# EasyEDA Pro project 主板&9V稳压.epro, schematic 主板V2

## Sheets
1 电源: Board Name: 主板V2; Create Date: 2025-04-24; Page Name: 电源; Project Name: （5月更新）主板&9V稳压; Schematic Name: 主板V2; Update Date: 2025-05-08; Company: 嘉立创EDA; Page Size: A4; Version: V1.0
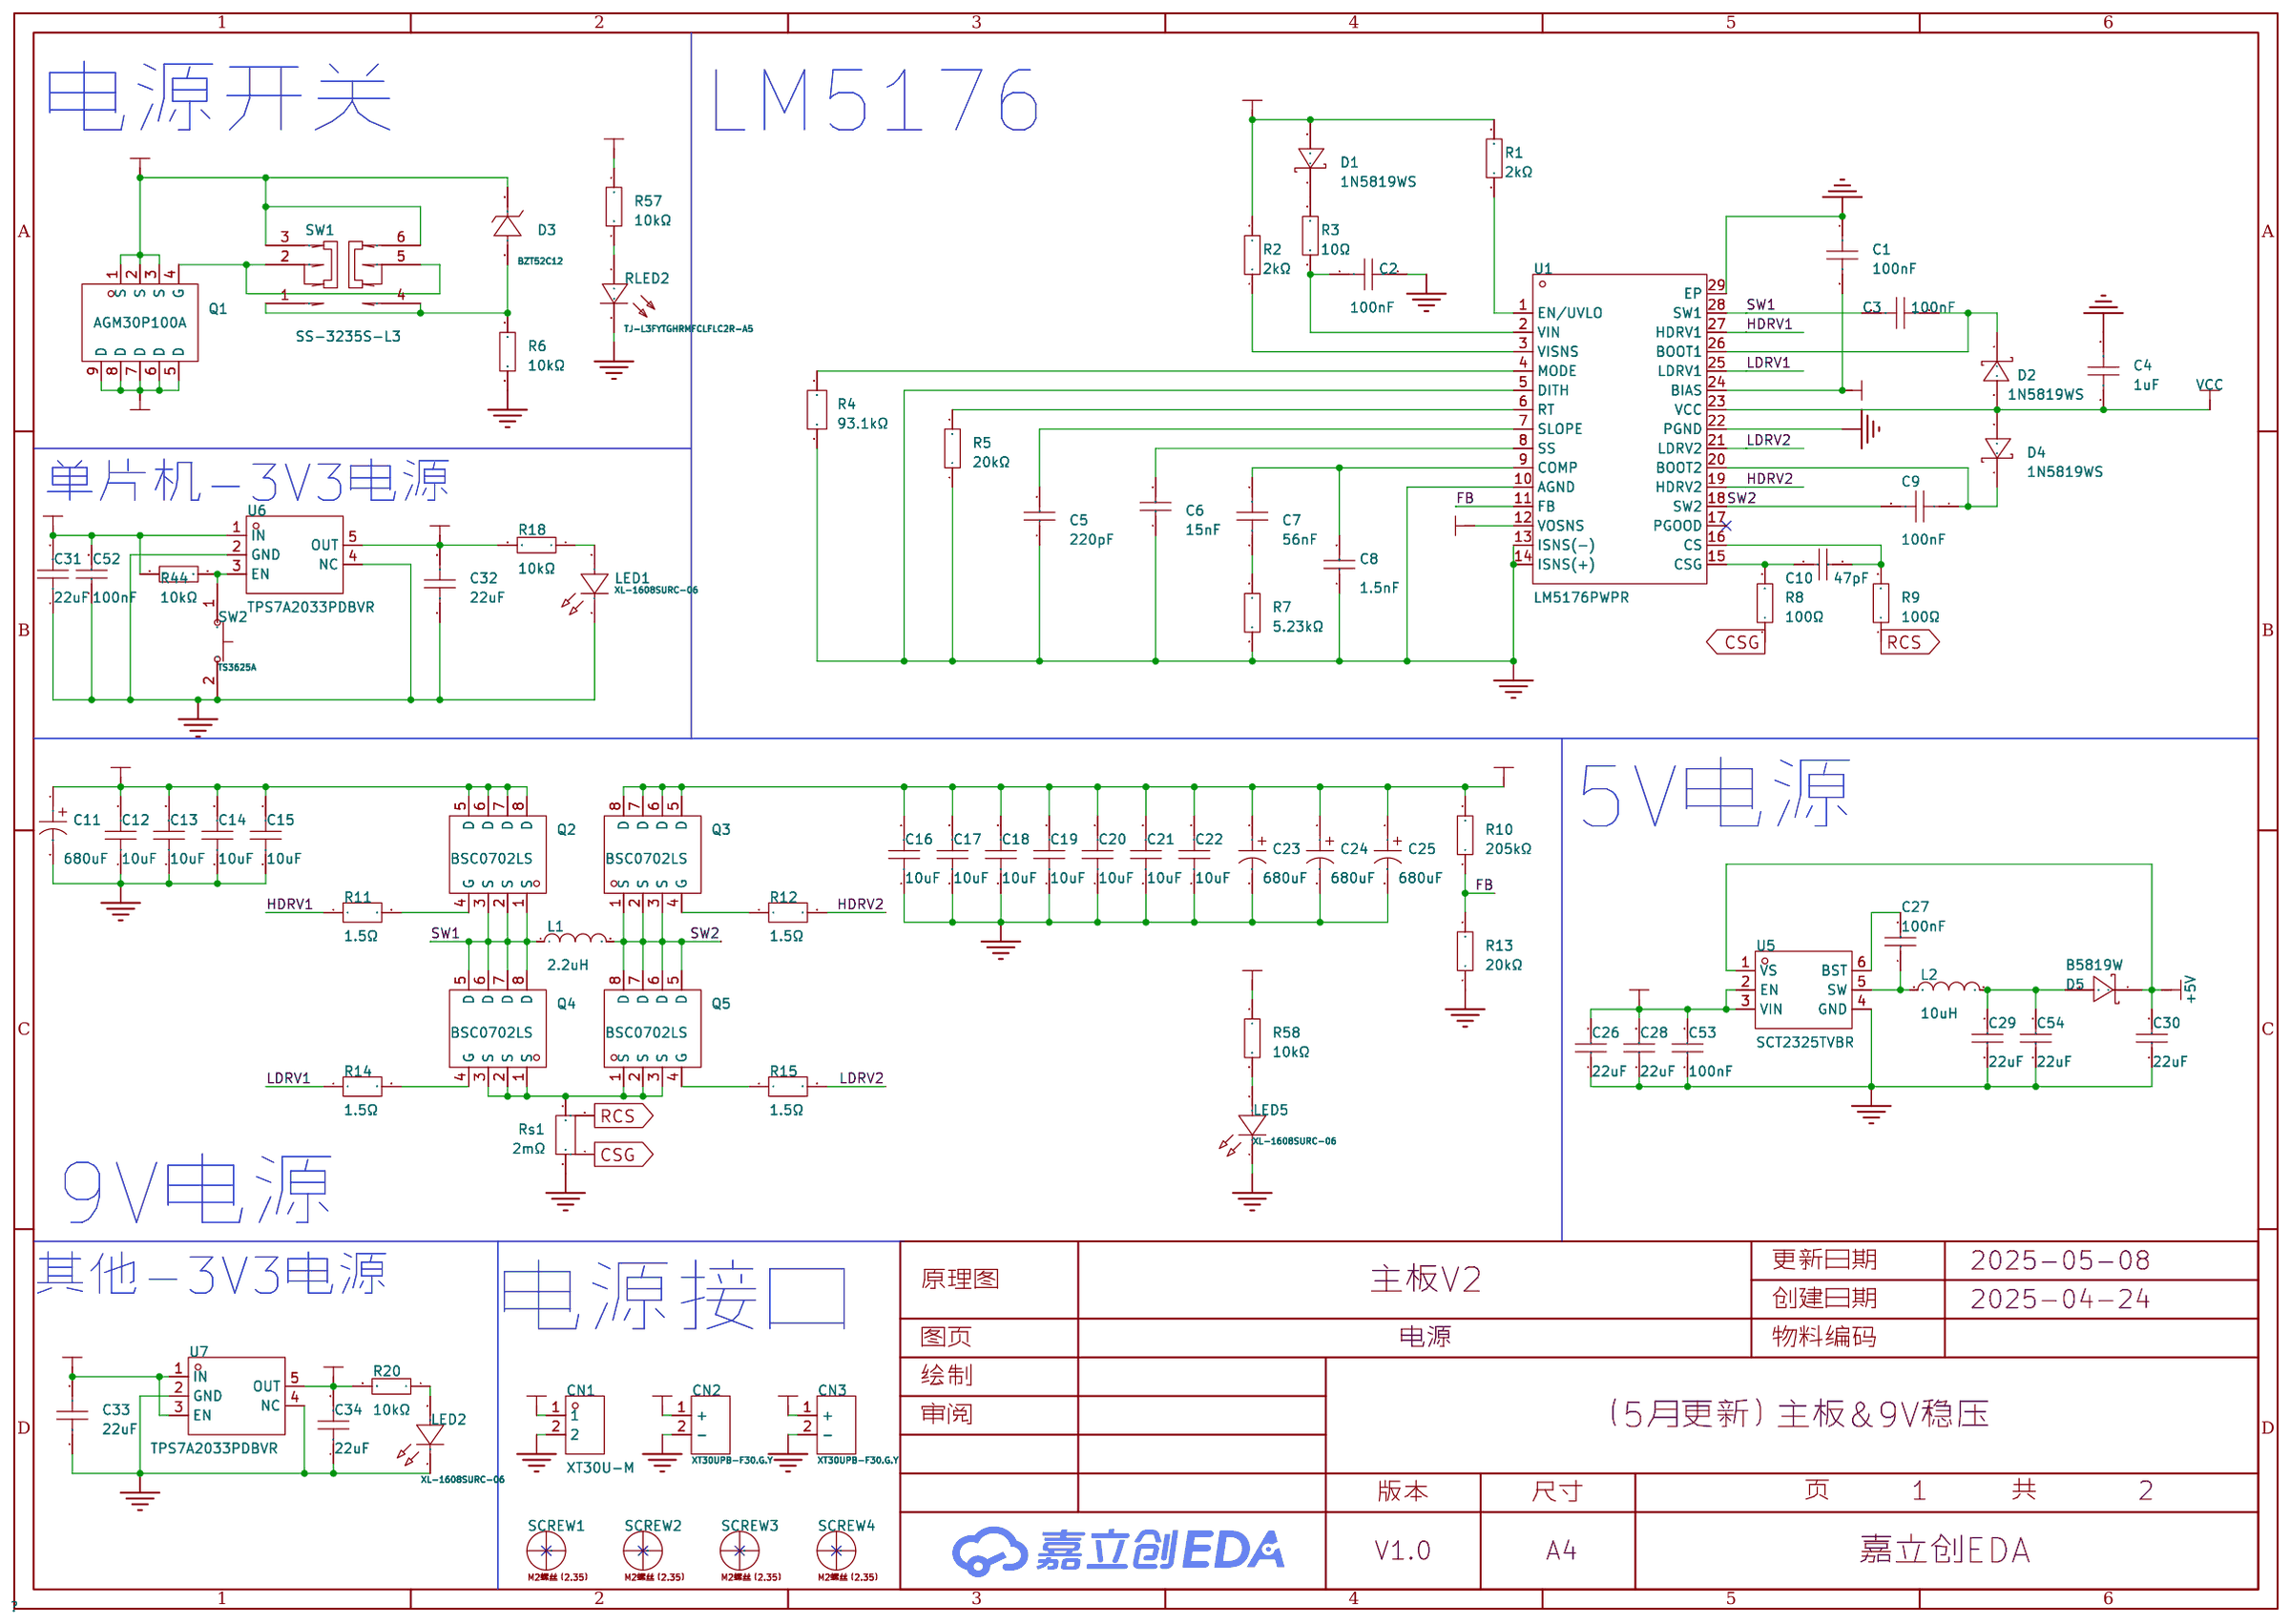
[diagram p2: 电源]
2 控制: Page Name: 控制; Project Name: （测试中）主板&9V稳压（螺丝孔扩大）; Update Date: 2025-05-04
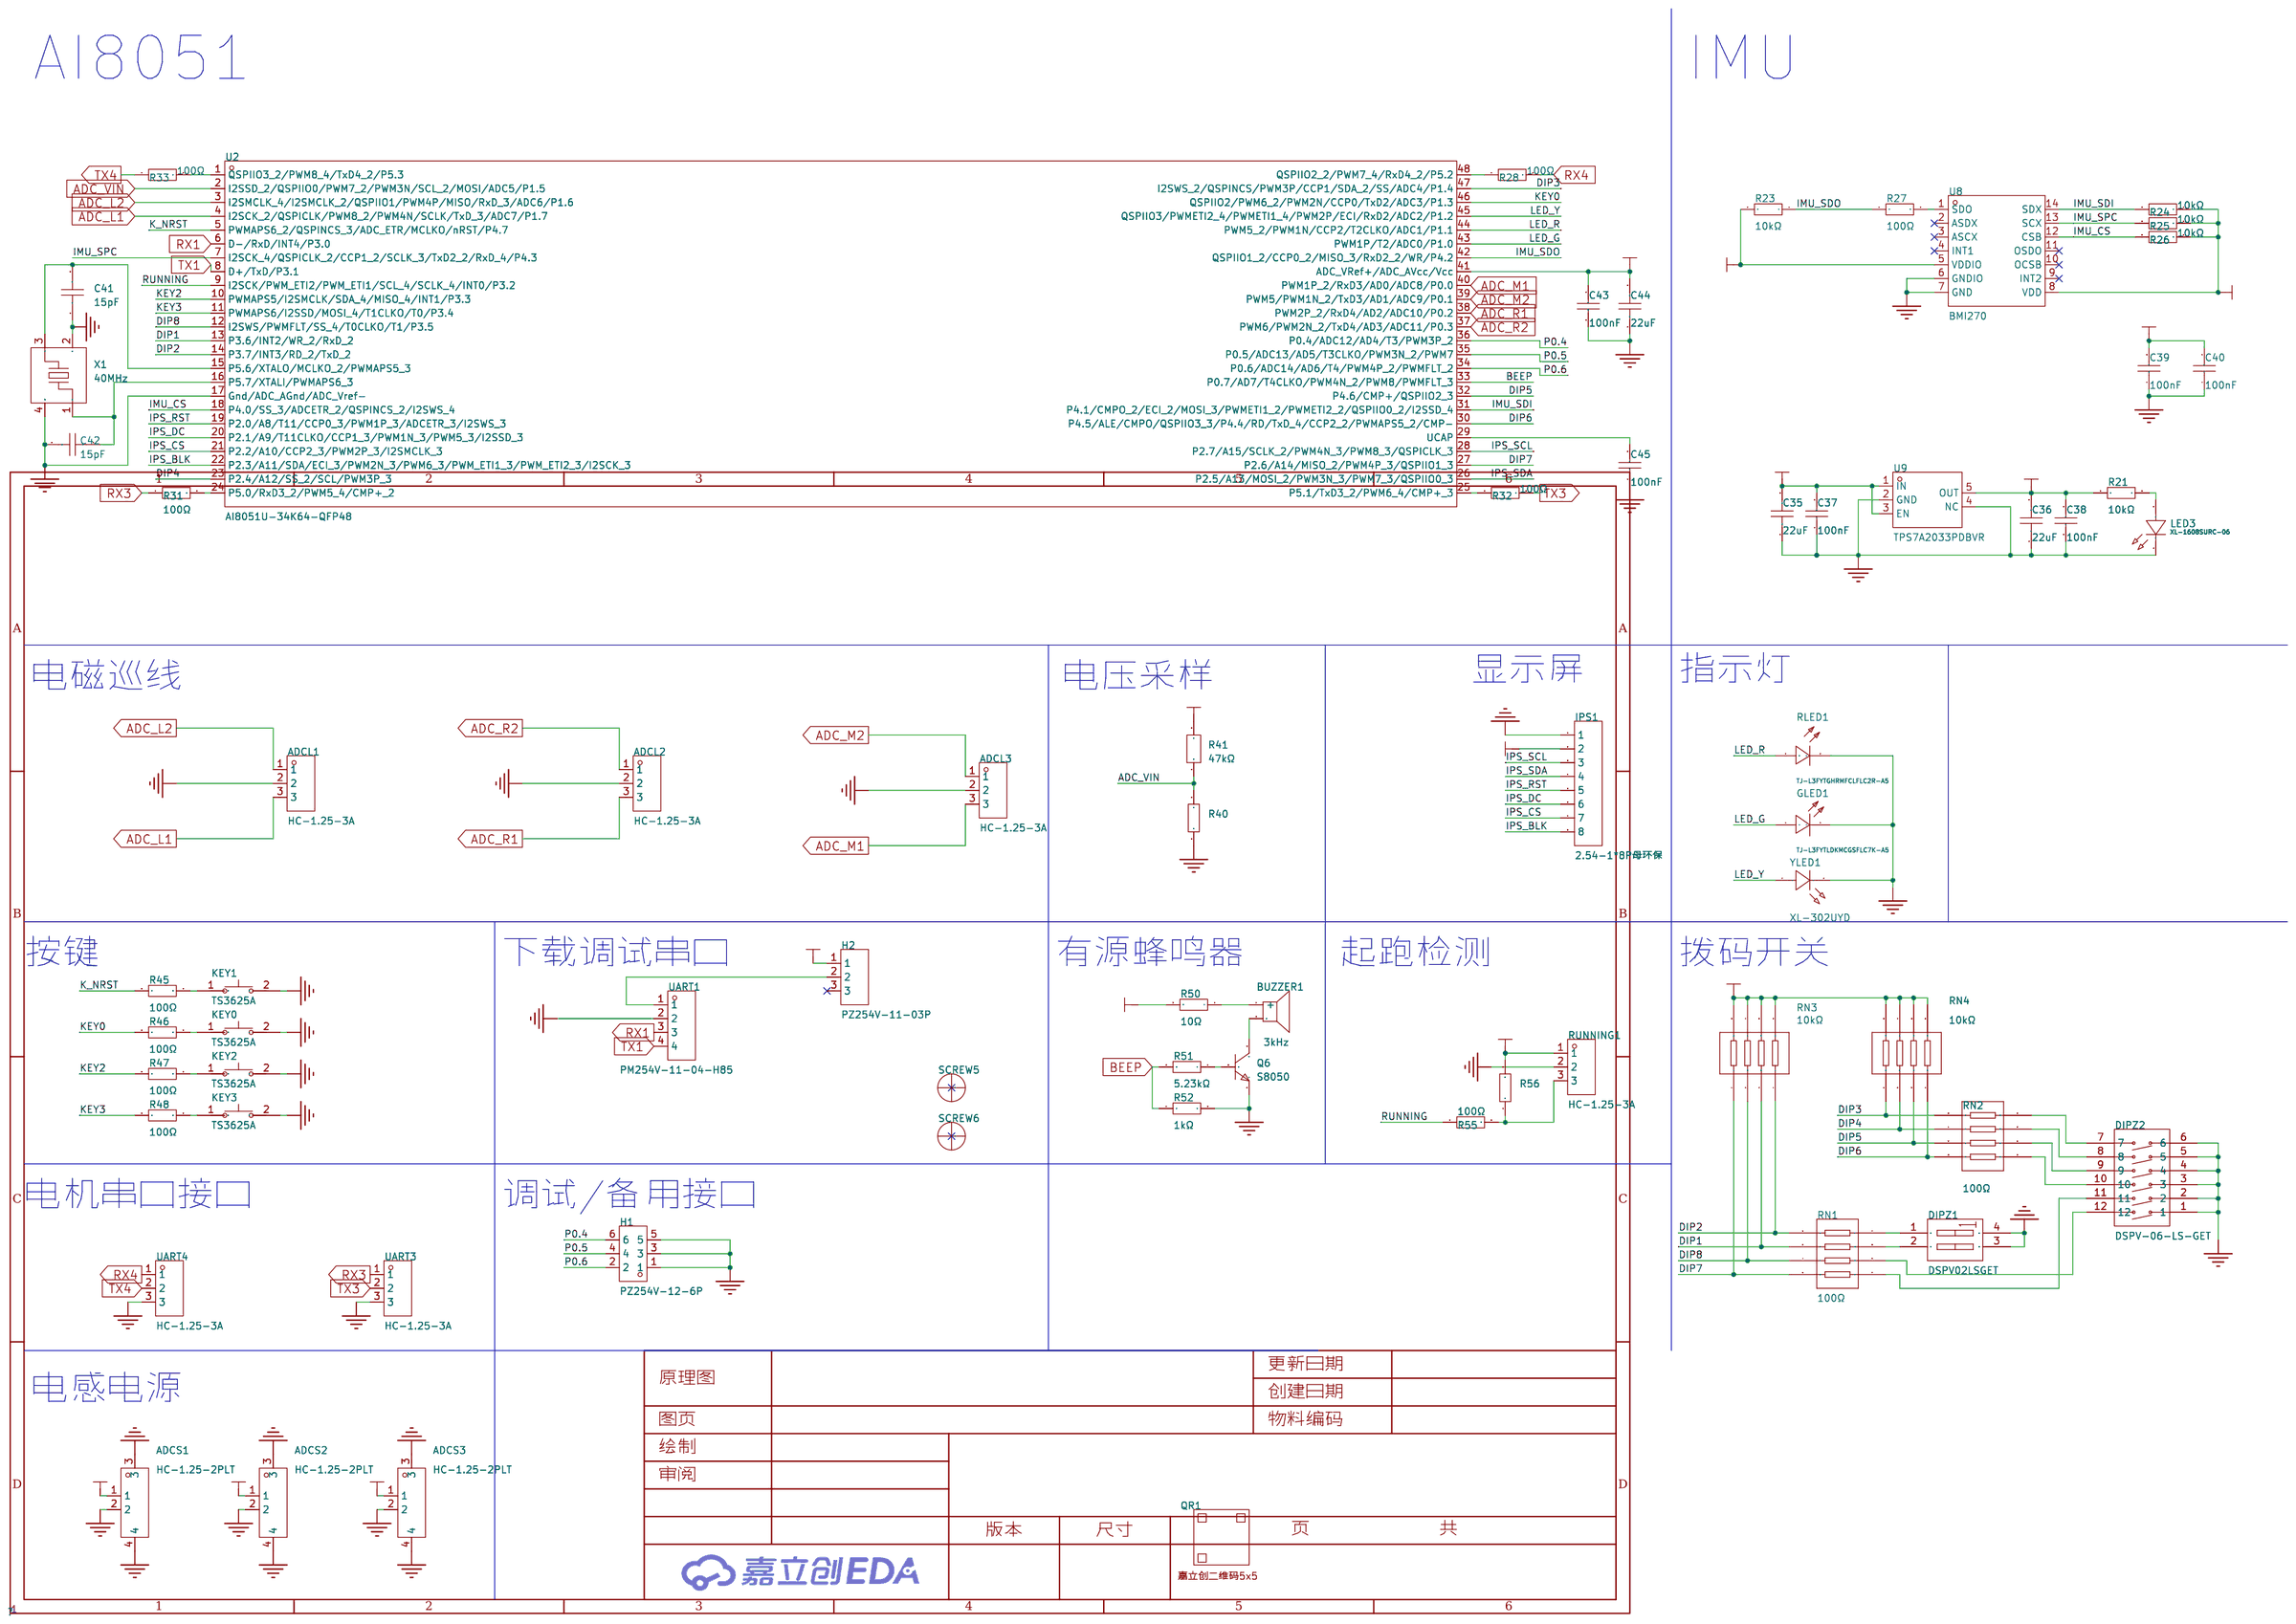
[diagram p3: 控制]

## Parts
sheet 控制
ADCL1  HC-1.25-3A  [CONN-TH_3P-P1.25_HCTL_HC-1.25-3A]
ADCL2  HC-1.25-3A  [CONN-TH_3P-P1.25_HCTL_HC-1.25-3A]
ADCL3  HC-1.25-3A  [CONN-TH_3P-P1.25_HCTL_HC-1.25-3A]
ADCS1  HC-1.25-2PLT  [CONN-SMD_HC-1.25-2PLT]
ADCS2  HC-1.25-2PLT  [CONN-SMD_HC-1.25-2PLT]
ADCS3  HC-1.25-2PLT  [CONN-SMD_HC-1.25-2PLT]
BUZZER1  3kHz  [BUZ-SMD_L9.6-W9.6-LS10.0-R]
C35  22uF  [C0603]
C36  22uF  [C0603]
C37  100nF  [C0603]
C38  100nF  [C0603]
C39  100nF  [C0603]
C40  100nF  [C0603]
C41  15pF  [C0603]
C42  15pF  [C0603]
C43  100nF  [C0603]
C44  22uF  [C0603]
C45  100nF  [C0603]
DIPZ1  DSPV02LSGET  [SW-SMD_DSPV02LSGET]
DIPZ2  DSPV-06-LS-GET  [SW-SMD_DSPV-06-LS-GET]
GLED1  TJ-L3FYTLDKMCGSFLC7K-A5  [LED-TH_BD3.8-P2.54-FD]
H1  PZ254V-12-6P  [HDR-TH_6P-P2.54-V-M-R2-C3-S2.54]
H2  PZ254V-11-03P  [HDR-TH_3P-P2.54-V-M]
IPS1  2.54-1*8P母环保  [HDR-TH_8P-P2.54-V-F-1]
KEY0  TS3625A  [KEY-SMD_L6.0-W3.5-LS8.4]
KEY1  TS3625A  [KEY-SMD_L6.0-W3.5-LS8.4]
KEY2  TS3625A  [KEY-SMD_L6.0-W3.5-LS8.4]
KEY3  TS3625A  [KEY-SMD_L6.0-W3.5-LS8.4]
LED3  XL-1608SURC-06  [LED0603-RD_RED]
Q6  S8050  [SOT-23-3_L2.9-W1.3-P1.90-LS2.3-BR]
QR1  -  [JLC-QRCODE-5x5]
R21  10kΩ  [R0603]
R23  10kΩ  [R0603]
R24  10kΩ  [R0603]
R25  10kΩ  [R0603]
R26  10kΩ  [R0603]
R27  100Ω  [R0603]
R28  100Ω  [R0603]
R31  100Ω  [R0603]
R32  100Ω  [R0603]
R33  100Ω  [R0603]
R40  10kΩ  [R0603]
R41  47kΩ  [R0603]
R45  100Ω  [R0603]
R46  100Ω  [R0603]
R47  100Ω  [R0603]
R48  100Ω  [R0603]
R50  10Ω  [R0603]
R51  5.23kΩ  [R0603]
R52  1kΩ  [R0603]
R55  100Ω  [R0603]
R56  10kΩ  [R0603]
RLED1  TJ-L3FYTGHRMFCLFLC2R-A5  [LED-TH_BD3.9-P2.54-FD]
RN1  100Ω  [RES-ARRAY-SMD_0603-8P-L3.2-W1.6-BL]
RN2  100Ω  [RES-ARRAY-SMD_0603-8P-L3.2-W1.6-BL]
RN3  10kΩ  [RES-ARRAY-SMD_0603-8P-L3.2-W1.6-BL]
RN4  10kΩ  [RES-ARRAY-SMD_0603-8P-L3.2-W1.6-BL]
RUNNING1  HC-1.25-3A  [CONN-TH_3P-P1.25_HCTL_HC-1.25-3A]
SCREW5  -  [M2螺丝]
SCREW6  -  [M2螺丝]
U2  AI8051U-34K64-QFP48  [LQFP-48_L7.0-W7.0-P0.50-LS9.0-BL_1]
U8  BMI270  [LGA-14_L3.0-W2.5-P0.50-BR]
U9  TPS7A2033PDBVR  [SOT-23-5_L2.9-W1.6-P0.95-LS2.8-BR]
UART1  PM254V-11-04-H85  [HDR-TH_4P-P2.54-V-F]
UART3  HC-1.25-3A  [CONN-TH_3P-P1.25_HCTL_HC-1.25-3A]
UART4  HC-1.25-3A  [CONN-TH_3P-P1.25_HCTL_HC-1.25-3A]
X1  40MHz  [CRYSTAL-SMD_4P-L3.2-W2.5-BL]
YLED1  XL-302UYD  [LED-TH_BD3.8-P2.54-FD_YELLOW]
sheet 电源
C1  100nF  [C0603]
C2  100nF  [C0603]
C3  100nF  [C0603]
C4  1uF  [C0603]
C5  220pF  [C0603]
C6  15nF  [C0603]
C7  56nF  [C0603]
C8  1.5nF  [C0603]
C9  100nF  [C0603]
C10  47pF  [C0603]
C11  680uF  [CAP-TH_BD8.0-P3.50-D0.6-FD]
C12  10uF  [C1206]
C13  10uF  [C1206]
C14  10uF  [C1206]
C15  10uF  [C1206]
C16  10uF  [C1206]
C17  10uF  [C1206]
C18  10uF  [C1206]
C19  10uF  [C1206]
C20  10uF  [C1206]
C21  10uF  [C1206]
C22  10uF  [C1206]
C23  680uF  [CAP-TH_BD8.0-P3.50-D0.6-FD]
C24  680uF  [CAP-TH_BD8.0-P3.50-D0.6-FD]
C25  680uF  [CAP-TH_BD8.0-P3.50-D0.6-FD]
C26  22uF  [C1206]
C27  100nF  [C0603]
C28  22uF  [C1206]
C29  22uF  [C1206]
C30  22uF  [C1206]
C31  22uF  [C0603]
C32  22uF  [C0603]
C33  22uF  [C0603]
C34  22uF  [C0603]
C52  100nF  [C0603]
C53  100nF  [C0603]
C54  22uF  [C1206]
CN1  XT30U-M  [CONN-TH_XT30U-M]
CN2  XT30UPB-F30.G.Y  [CONN-TH_XT30UPB-F]
CN3  XT30UPB-F30.G.Y  [CONN-TH_XT30UPB-F]
D1  1N5819WS  [SOD-323_L1.8-W1.3-LS2.5-RD]
D2  1N5819WS  [SOD-323_L1.8-W1.3-LS2.5-RD]
D3  BZT52C12  [SOD-123_L2.7-W1.6-LS3.7-RD]
D4  1N5819WS  [SOD-323_L1.8-W1.3-LS2.5-RD]
D5  B5819W  [SOD-123_L2.8-W1.8-LS3.7-RD]
L1  2.2uH  [IND-SMD_L11.9-W11.0]
L2  10uH  [IND-SMD_L3.0-W3.0_FTC303020D]
LED1  XL-1608SURC-06  [LED0603-RD_RED]
LED2  XL-1608SURC-06  [LED0603-RD_RED]
LED5  XL-1608SURC-06  [LED0603-RD_RED]
Q1  AGM30P100A  [PDFN-8_L5.8-W4.9-P1.27-LS6.1-BL-A]
Q2  BSC0702LS  [PG-TDSON-8_L5.0-W6.0-P1.27-BL-EP]
Q3  BSC0702LS  [PG-TDSON-8_L5.0-W6.0-P1.27-BL-EP]
Q4  BSC0702LS  [PG-TDSON-8_L5.0-W6.0-P1.27-BL-EP]
Q5  BSC0702LS  [PG-TDSON-8_L5.0-W6.0-P1.27-BL-EP]
R1  2kΩ  [R0603]
R2  2kΩ  [R0603]
R3  10Ω  [R0603]
R4  93.1kΩ  [R0603]
R5  20kΩ  [R0603]
R6  10kΩ  [R0603]
R7  5.23kΩ  [R0603]
R8  100Ω  [R0603]
R9  100Ω  [R0603]
R10  205kΩ  [R0603]
R11  1.5Ω  [R0603]
R12  1.5Ω  [R0603]
R13  20kΩ  [R0603]
R14  1.5Ω  [R0603]
R15  1.5Ω  [R0603]
R18  10kΩ  [R0603]
R20  10kΩ  [R0603]
R44  10kΩ  [R0603]
R57  10kΩ  [R0603]
R58  10kΩ  [R0603]
RLED2  TJ-L3FYTGHRMFCLFLC2R-A5  [LED-TH_BD3.9-P2.54-FD]
Rs1  2mΩ  [RES-SMD_4P-L3.0-W3.8_HOBB1216]
SCREW1  -  [M2螺丝（2.35）]
SCREW2  -  [M2螺丝（2.35）]
SCREW3  -  [M2螺丝（2.35）]
SCREW4  -  [M2螺丝（2.35）]
SW1  SS-3235S-L3  [SW-SMD_SS-3235S-L3.00]
SW2  TS3625A  [KEY-SMD_L6.0-W3.5-LS8.4]
U1  LM5176PWPR  [HTSSOP-28_L9.7-W4.4-P0.65-LS6.4-BL-EP]
U5  SCT2325TVBR  [TSOT-23-6_L2.9-W1.6-P0.95-LS2.8-BR]
U6  TPS7A2033PDBVR  [SOT-23-5_L2.9-W1.6-P0.95-LS2.8-BR]
U7  TPS7A2033PDBVR  [SOT-23-5_L2.9-W1.6-P0.95-LS2.8-BR]

## Library data of the parts
ADCL1-ADCL3 RUNNING1 UART3 UART4 = HC-1.25-3A: 插针结构:1x3P;间距:1.25mm;安装方式:直插;参考系列:PicoBlade(MX 1.25);总PIN数:3P;排数:1;每排PIN数:3;行距:-;额定电流:1A;触头材质:黄铜;触头镀层:锡;工作温度范围:-25℃~+85℃;; LCSC Part Name: 1x3P 间距:1.25mm 直插 系列:PicoBlade(MX 1.25); Supplier Part: C2845521; Manufacturer: HCTL(华灿天禄); Supplier Footprint: 插件,P=1.25mm; JLCPCB Part Class: 扩展库; Datasheet: https://atta.szlcsc.com/upload/public/pdf/source/20230707/9C9BC153C15CECDA5FD17EC6041C1792.pdf; Supplier: LCSC; Pins Structure: 1x3P; Pitch: 1.25mm; Mounting Style: 直插; Reference Series: PicoBlade(MX 1.25); Number of Pins: 3P; Number of Rows: 1; Number of PINs Per Row: 3; Current Rating (Max): 1A; Contact Material: 黄铜; Contact Plating: 锡; Operating Temperature Range: -25℃~+85℃; Rated Voltage (Max): 125V; Plastic Material: PA46; Flame Retardant Rating: UL94V-0; Z-Height of the Board: 4.7mm; X-Length of Bottom Edge on Board (Spacing Line): 5.5mm; Y-Width of Bottom Edge on Board: 3.2mm
ADCS1-ADCS3 = HC-1.25-2PLT: 插针结构:1x2P;间距:1.25mm;安装方式:立贴;参考系列:PicoBlade(MX 1.25);总PIN数:2P;排数:1;每排PIN数:2;行距:-;额定电流:2A;触头材质:黄铜;触头镀层:锡;工作温度范围:-25℃~+85℃;; LCSC Part Name: 1x2P 间距:1.25mm 立贴 系列:PicoBlade(MX 1.25); Supplier Part: C2845388; Manufacturer: HCTL(华灿天禄); Supplier Footprint: SMD,P=1.25mm; JLCPCB Part Class: 扩展库; Datasheet: https://atta.szlcsc.com/upload/public/pdf/source/20230707/8E5913B5A3195C18F5EE12EA4CB86B82.pdf; Supplier: LCSC; Pins Structure: 1x2P; Pitch: 1.25mm; Mounting Style: 立贴; Reference Series: PicoBlade(MX 1.25); Number of Pins: 2P; Number of Rows: 1; Number of PINs Per Row: 2; Current Rating (Max): 2A; Contact Material: 黄铜; Contact Plating: 锡; Operating Temperature Range: -25℃~+85℃; Rated Voltage (Max): 250V; Plastic Material: LCP; Flame Retardant Rating: UL94V-0; Supplementary Features: 辅助焊脚; Z-Height of the Board: 4.75mm; X-Length of Bottom Edge on Board (Spacing Line): 7.3mm; Y-Width of Bottom Edge on Board: 4.2mm
BUZZER1 = FUET-9650B-3V: 驱动方式:有源(内含驱动线路);构造类型:电磁式;频率:3kHz;声压(SPL):85dB;; LCSC Part Name: 电压 3V 频率 3KHZ; Supplier Part: C391032; Manufacturer: FUET(福声科技); Supplier Footprint: SMD,9.6x9.6mm; JLCPCB Part Class: 扩展库; Datasheet: https://atta.szlcsc.com/upload/public/pdf/source/20191031/C391032_DAAC75D3C9B9135EF0EA60697D179A21.pdf; Supplier: LCSC; Driver Circuitry: 有源(内含驱动线路); Technology: 电磁式; Voltage - Supply: 2V~5V; Sound Pressure Level(SPL): 85dB; Length: 9.6mm; Width: 9.6mm; Height: 5.5mm
C31-C36 C44 = CL10A226MQ8NRNC: 容值:22uF;精度:±20%;额定电压:6.3V;材质(温度系数):X5R;; LCSC Part Name: 22uF ±20% 6.3V; Supplier Part: C59461; Manufacturer: SAMSUNG(三星); Supplier Footprint: 0603; JLCPCB Part Class: 基础库; Datasheet: https://atta.szlcsc.com/upload/public/pdf/source/20160218/1457707763339.pdf; Supplier: LCSC; Tolerance: ±20%; Voltage Rated: 6.3V; Temperature Coefficient: X5R
C1-C3 C9 C27 C37-C40 C43 C45 C52 C53 = CC0603KRX7R9BB104: 容值:100nF;精度:±10%;额定电压:50V;材质(温度系数):X7R;; LCSC Part Name: 100nF ±10% 50V; Supplier Part: C14663; Manufacturer: YAGEO(国巨); Supplier Footprint: 0603; JLCPCB Part Class: 基础库; Datasheet: https://atta.szlcsc.com/upload/public/pdf/source/20180910/C282072_33301C7F631E79921B82A8DAC6BCC5B3.pdf; Supplier: LCSC; Tolerance: ±10%; Voltage Rated: 50V; Temperature Coefficient: X7R
C41 C42 = CC0603FRNPO9BN150: 容值:15pF;精度:±1%;额定电压:50V;材质(温度系数):NP0;; LCSC Part Name: 15pF ±1% 50V; Supplier Part: C519483; Manufacturer: YAGEO(国巨); Supplier Footprint: 0603; JLCPCB Part Class: Extended Part; Datasheet: https://atta.szlcsc.com/upload/public/pdf/source/20200423/C519483_4C1E224DC9F50100F87DB4C4CB862A47.pdf; Supplier: LCSC; Tolerance: ±1%; Voltage Rated: 50V; Temperature Coefficient: NP0
DIPZ1 = DSPV02LSGET_C3293167: 类型:琴键;电路结构:单刀单掷;开关位数:2位;额定电流:25mA;额定电压:24V;使用寿命:3千次;颜色:黑色;; LCSC Part Name: 2位 2.54间距贴片型 琴键式侧拨 黑色拨码开关 拨动开关; Supplier Part: C3293167; Manufacturer: 康深; Supplier Footprint: SMD-4P,6.5x9mm; JLCPCB Part Class: 扩展库; Datasheet: https://atta.szlcsc.com/upload/public/pdf/source/20220713/19B05D0406997D0F6DA59F33D283E3E5.pdf; Supplier: LCSC; Type: 琴键; Circuit: 单刀单掷; Number of Positions: 2位; Lead Pitch: 2.54mm; Current Rating: 25mA; Voltage Rating: 24V; Operating Temperature: -30℃~+85℃; Operating Life: 3千次; Color: 黑色
DIPZ2 = DSPV-06-LS-GET: 类型:琴键;电路结构:单刀单掷;开关位数:6位;额定电流:25mA;额定电压:24V;使用寿命:3千次;颜色:黑色;; LCSC Part Name: 2.54mm间距 6位 琴键式贴片侧拨 黑色 拨码开关; Supplier Part: C7503432; Manufacturer: XUNPU(讯普); Supplier Footprint: SMD,P=2.54mm; JLCPCB Part Class: 扩展库; Datasheet: https://atta.szlcsc.com/upload/public/pdf/source/20231023/A13819BA6D566F6DF481D09D8C1ADCC0.pdf; Supplier: LCSC; Type: 琴键; Circuit: 单刀单掷; Number of Positions: 6位; Lead Pitch: 2.54mm; Current Rating: 25mA; Voltage Rating: 24V; Operating Life: 3千次; Color: 黑色
GLED1 = TJ-L3FYTLDKMCGSFLC7K-A5: 灯头类型:3mm圆形灯头;发光颜色:黄绿色;功率:72mW;正向电流:20mA;主波长:565nm~575nm;二极管配置:-;透镜颜色:雾状绿透镜;色温:-;发光角度:45°;载带方式:-;工作温度:-20℃~+80℃;; LCSC Part Name: 普绿/黄绿; Supplier Part: C440524; Manufacturer: TOGIALED(统佳); Supplier Footprint: 插件,D=3mm; JLCPCB Part Class: 扩展库; Datasheet: https://atta.szlcsc.com/upload/public/pdf/source/20191029/C440524_094602A0DCAC6D730972557558F5FC64.pdf; Supplier: LCSC; Lamp Holder Type: 3mm圆形灯头; Emitted Color: 黄绿色; Power Dissipation: 72mW; Forward Current: 20mA; Dominant Wavelength: 565nm~575nm; Peak Wavelength: 575nm; Lens Color: 雾状绿透镜; Viewing Angle: 45°; Operating Temperature: -20℃~+80℃
H1 = PZ254V-12-6P: 插针结构:2x3P;间距:2.54mm;行距:2.54mm;圆针/方针:方针;安装类型:直插;排数:双排;总PIN位数:6P;额定电流:-;额定电压:-;配合针长度:6mm;塑高:2.5mm;端接针长度:3mm;触头材质:黄铜;触头镀层:-;工作温度范围:-40℃~+105℃;颜色:黑色;; LCSC Part Name: 间距:2.54mm 2x3P 直插 方针; Supplier Part: C492420; Manufacturer: XFCN(兴飞); Supplier Footprint: 插件,P=2.54mm; JLCPCB Part Class: 扩展库; Datasheet: https://atta.szlcsc.com/upload/public/pdf/source/20200309/C492420_BAECB307B001054C09D200388220EAE6.pdf; Supplier: LCSC; Pin Structure: 2x3P; Pitch: 2.54mm; Row Spacing: 2.54mm; Circluar Pins/Square Pins: 方针; Mounting Type: 直插; Number of Rows: 双排; Number of Pins: 6P; Length of Mating Pin: 6mm; Insulation Height: 2.5mm; Length of End Connection Pin: 3mm; Contact Material: 黄铜; Operating Temperature Range: -40℃~+105℃; Color: 黑色
H2 = PZ254V-11-03P: 插针结构:1x3P;间距:2.54mm;行距:-;圆针/方针:方针;安装方式:直插;排数:单排;总PIN位数:3P;额定电流:3A;额定电压:250V;配合针长度:6mm;塑高:2.5mm;端接针长度:3mm;工作温度:-40℃~+105℃;颜色:黑色;; LCSC Part Name: 1x3P 间距:2.54mm 方针 直插; Supplier Part: C2937625; Manufacturer: XFCN(兴飞); Supplier Footprint: 插件,P=2.54mm; JLCPCB Part Class: 扩展库; Datasheet: https://atta.szlcsc.com/upload/public/pdf/source/20200309/C492402_8335C3D49C4E4C618838D59BB1D024C1.pdf; Supplier: LCSC; Pin Structure: 1x3P; Pitch: 2.54mm; Circluar Pins/Square Pins: 方针; Mounting Type: 直插; Number of Rows: 单排; Number of Pins: 3P; Current Rating: 3A; Voltage Rating (Max): 250V; Length of Mating Pin: 6mm; Insulation Height: 2.5mm; Length of End Connection Pin: 3mm; Operating Temperature: -40℃~+105℃; Color: 黑色
IPS1 = 2.54-1*8P母环保: 插孔结构:1x8P;间距:2.54mm;行距:-;安装类型:直插;排数:单排;总孔位数:8P;塑高:-;触头材质:-;触头镀层:-;; LCSC Part Name: 间距:2.54mm 1x8P 直插; Supplier Part: C27438; Manufacturer: BOOMELE(博穆精密); Supplier Footprint: 插件,P=2.54mm; JLCPCB Part Class: 扩展库; Datasheet: https://atta.szlcsc.com/upload/public/pdf/source/20231221/1CA800C6799ED97958773716FAA1BFFE.pdf; Supplier: LCSC; Holes Structure: 1x8P; Pitch: 2.54mm; Mounting Type: 直插; Number of Rows: 单排; Number of Holes: 8P
KEY0-KEY3 SW2 = TS3625A: 电路结构:单刀单掷;按钮形状:矩形按钮;开关长度:6.1mm;开关宽度:3.65mm;开关高度:2.5mm;触点电流:50mA;额定电压(DC):12V;安装方式:立贴;带灯:-;作用力:250gf;机械寿命:-;; LCSC Part Name: 6.1*3.65*2.5mm 立贴 轻触开关; Supplier Part: C398053; Manufacturer: SHOU HAN(首韩); Supplier Footprint: SMD; Datasheet: https://atta.szlcsc.com/upload/public/pdf/source/20190620/C398053_EFFFB524A3F966B1F45EE8333D1EDECC.pdf; Supplier: LCSC; Circuit: 单刀单掷; Actuator Style: 矩形按钮; Switch Length: 6.1mm; Switch Width: 3.65mm; Switch Height: 2.5mm; Contact Current: 50mA; Voltage Rating (DC): 12V; Mounting Style: 立贴; Operating Force: 250gf
LED1-LED3 LED5 = XL-1608SURC-06: 发光颜色:红色;功率:55mW;正向电流:25mA;主波长:617nm~621nm;透镜颜色:无色透明透镜;色温:-;发光角度:120°;载带方式:正贴;工作温度:-30℃~+85℃;; Supplier Part: C965799; Manufacturer: XINGLIGHT(成兴光); Supplier Footprint: 0603; JLCPCB Part Class: 扩展库; Datasheet: https://atta.szlcsc.com/upload/public/pdf/source/20221102/D860AFDD1CDB02C5A8064103A32707E2.pdf; Supplier: LCSC; Emitted Color: 红色; Power Dissipation: 55mW; Forward Current: 25mA; Dominant Wavelength: 617nm~621nm; Peak Wavelength: 623nm; Lens Color: 无色透明透镜; Viewing Angle: 120°; Mounting Sytle: 正贴; Operating Temperature: -30℃~+85℃
Q6 = S8050_C20069125: 晶体管类型:NPN;集电极电流(Ic):500mA;集射极击穿电压(Vceo):25V;耗散功率(Pd):300mW;直流电流增益(hFE):120@50mA,1.0V;; LCSC Part Name: hFE:200-350，丝印:J3Y S8050; Supplier Part: C20069125; Manufacturer: 宏嘉诚; Supplier Footprint: SOT-23; JLCPCB Part Class: 扩展库; Datasheet: https://atta.szlcsc.com/upload/public/pdf/source/20250107/343E8B94B5C24D0D65D7D4B70E0B73F6.pdf; Supplier: LCSC; type: NPN; Current - Collector(Ic): 500mA; Collector - Emitter Voltage VCEO: 25V; Pd - Power Dissipation: 300mW; DC Current Gain: 120@50mA,1.0V; Transition frequency(fT): 100MHz; Current - Collector Cutoff: 100nA; Vce Saturation(VCE(sat)): 600mV; Operating Temperature: -55℃~+150℃
QR1 = 嘉立创二维码5x5: Check: false
R6 R18 R20 R21 R23-R26 R40 R44 R56-R58 = RC0603FR-0710KL: 电阻类型:厚膜电阻;阻值:10kΩ;精度:±1%;功率:100mW;最大工作电压:75V;温度系数:±100ppm/℃;; LCSC Part Name: 厚膜电阻 10kΩ ±1% 100mW; Supplier Part: C98220; Manufacturer: YAGEO(国巨); Supplier Footprint: 0603; JLCPCB Part Class: Extended Part; Datasheet: https://atta.szlcsc.com/upload/public/pdf/source/20180927/C295883_E8D83085EA81BD7DE0B2B681138C15EE.pdf; Supplier: LCSC; Type: 厚膜电阻; Tolerance: ±1%; Power(Watts): 100mW; Overload Voltage (Max): 75V; Temperature Coefficient: ±100ppm/℃; Operating Temperature Range: -55℃~+155℃
R8 R9 R27 R28 R31-R33 = RC0603FR-07100RL: 电阻类型:厚膜电阻;阻值:100Ω;精度:±1%;功率:100mW;最大工作电压:75V;温度系数:±100ppm/℃;; LCSC Part Name: 厚膜电阻 100Ω ±1% 100mW; Supplier Part: C105588; Manufacturer: YAGEO(国巨); Supplier Footprint: 0603; JLCPCB Part Class: 扩展库; Datasheet: https://atta.szlcsc.com/upload/public/pdf/source/20180316/70C0E2BDAE7FCC62C531A5A58D202EE1.pdf; Supplier: LCSC; Type: 厚膜电阻; Tolerance: ±1%; Power(Watts): 100mW; Overload Voltage (Max): 75V; Temperature Coefficient: ±100ppm/℃; Operating Temperature Range: -55℃~+155℃
R41 = FRC0603F4702TS: 电阻类型:厚膜电阻;阻值:47kΩ;精度:±1%;功率:100mW;最大工作电压:75V;温度系数:±100ppm/℃;; LCSC Part Name: 47kΩ ±1% 100mW 厚膜电阻; Supplier Part: C2907042; Manufacturer: FOJAN(富捷); Supplier Footprint: 0603; JLCPCB Part Class: 扩展库; Datasheet: https://atta.szlcsc.com/upload/public/pdf/source/20211221/925EC7D7225764EE0046F22065062C87.pdf; Supplier: LCSC; Type: 厚膜电阻; Tolerance: ±1%; Power(Watts): 100mW; Overload Voltage (Max): 75V; Temperature Coefficient: ±100ppm/℃; Operating Temperature Range: -55℃~+155℃
R45-R48 R55 = RC0603FR-07100RL: 电阻类型:厚膜电阻;阻值:100Ω;精度:±1%;功率:100mW;最大工作电压:75V;温度系数:±100ppm/℃;; LCSC Part Name: 厚膜电阻 100Ω ±1% 100mW; Supplier Part: C105588; Manufacturer: YAGEO(国巨); Supplier Footprint: 0603; JLCPCB Part Class: Extended Part; Datasheet: https://atta.szlcsc.com/upload/public/pdf/source/20180316/70C0E2BDAE7FCC62C531A5A58D202EE1.pdf; Supplier: LCSC; Type: 厚膜电阻; Tolerance: ±1%; Power(Watts): 100mW; Overload Voltage (Max): 75V; Temperature Coefficient: ±100ppm/℃; Operating Temperature Range: -55℃~+155℃
R3 R50 = 0603WAF100JT5E: 电阻类型:厚膜电阻;阻值:10Ω;精度:±1%;功率:100mW;最大工作电压:75V;温度系数:±400ppm/℃;; LCSC Part Name: 10Ω ±1% 100mW 厚膜电阻; Supplier Part: C22859; Manufacturer: UNI-ROYAL(厚声); Supplier Footprint: 0603; Datasheet: https://atta.szlcsc.com/upload/public/pdf/source/20200306/C422600_1E6D84923E4A46A82E41ADD87F860B5C.pdf; Supplier: LCSC; Type: 厚膜电阻; Tolerance: ±1%; Power(Watts): 100mW; Overload Voltage (Max): 75V; Temperature Coefficient: ±400ppm/℃; Operating Temperature Range: -55℃~+155℃
R7 R51 = 0603WAF5231T5E: 电阻类型:厚膜电阻;阻值:5.23kΩ;精度:±1%;功率:100mW;最大工作电压:75V;温度系数:±100ppm/℃;; LCSC Part Name: 5.23kΩ ±1% 100mW 厚膜电阻; Supplier Part: C23068; Manufacturer: UNI-ROYAL(厚声); Supplier Footprint: 0603; JLCPCB Part Class: Extended Part; Datasheet: https://atta.szlcsc.com/upload/public/pdf/source/20200306/C422600_1E6D84923E4A46A82E41ADD87F860B5C.pdf; Supplier: LCSC; Type: 厚膜电阻; Tolerance: ±1%; Power(Watts): 100mW; Overload Voltage (Max): 75V; Temperature Coefficient: ±100ppm/℃; Operating Temperature Range: -55℃~+155℃
R52 = RC0603FR-071KL: 电阻类型:厚膜电阻;阻值:1kΩ;精度:±1%;功率:100mW;最大工作电压:75V;温度系数:±100ppm/℃;; LCSC Part Name: 厚膜电阻 1kΩ ±1% 100mW; Supplier Part: C22548; Manufacturer: YAGEO(国巨); Supplier Footprint: 0603; JLCPCB Part Class: 扩展库; Datasheet: https://atta.szlcsc.com/upload/public/pdf/source/20180316/70C0E2BDAE7FCC62C531A5A58D202EE1.pdf; Supplier: LCSC; Type: 厚膜电阻; Tolerance: ±1%; Power(Watts): 100mW; Overload Voltage (Max): 75V; Temperature Coefficient: ±100ppm/℃; Operating Temperature Range: -55℃~+155℃
RLED1 RLED2 = TJ-L3FYTGHRMFCLFLC2R-A5: 灯头类型:3mm圆形灯头;发光颜色:红色;; LCSC Part Name: 红灯; Supplier Part: C330774; Manufacturer: TOGIALED(统佳); Supplier Footprint: 插件,D=3mm; JLCPCB Part Class: 扩展库; Datasheet: https://atta.szlcsc.com/upload/public/pdf/source/20190107/C330774_64C7749B407D2BABAE49AD51165D6CF8.pdf; Supplier: LCSC; Lamp Holder Type: 3mm圆形灯头; Emitted Color: 红色
RN1 RN2 = YC164-FR-07100RL: 电阻器数:4;阻值:100Ω;精度:±1%;单个元件功率:62.5mW;温度系数:±200ppm/℃;; LCSC Part Name: 100Ω ±1% 0603x4; Supplier Part: C136838; Manufacturer: YAGEO(国巨); Supplier Footprint: 0603x4; JLCPCB Part Class: 扩展库; Datasheet: https://atta.szlcsc.com/upload/public/pdf/source/20180730/C256814_200CCA6CC84D78D7E49AE6680727F338.pdf; Supplier: LCSC; Number of Resistors: 4; Tolerance: ±1%; Power(Watts): 62.5mW; Temperature Coefficient: ±200ppm/℃; Number of Pins: 8
RN3 RN4 = YC164-FR-0710KL: 电阻器数:4;阻值:10kΩ;精度:±1%;单个元件功率:62.5mW;温度系数:±200ppm/℃;; LCSC Part Name: 10kΩ ±1% 0603x4; Supplier Part: C110924; Manufacturer: YAGEO(国巨); Supplier Footprint: 0603x4; JLCPCB Part Class: 扩展库; Datasheet: https://atta.szlcsc.com/upload/public/pdf/source/20170912/C110924_1505207735334963352.pdf; Supplier: LCSC; Number of Resistors: 4; Tolerance: ±1%; Power(Watts): 62.5mW; Temperature Coefficient: ±200ppm/℃; Number of Pins: 8
SCREW5 SCREW6 = M2螺丝: Check: false
U2 = AI8051U-34K64-QFP48: 硬件浮点/硬件三角函数 跑100MHz, 32位8051-CPU 跑 42MHz，PWM 有硬件移相功能，DMA支持外设到外设，DMA支持PWM; Supplier Part: C41427635; Manufacturer: STC; Supplier Footprint: QFP-48; JLCPCB Part Class: 扩展库; Datasheet: https://atta.szlcsc.com/upload/public/pdf/source/20241012/98E0A3F17C9CC280218AE3F266CCDE47.pdf; Supplier: LCSC
U8 = BMI270: 传感器类型:加速度计陀螺仪;; Supplier Part: C2836813; Manufacturer: Bosch(博世); Supplier Footprint: LGA-14(2.5x3); JLCPCB Part Class: 扩展库; Datasheet: https://atta.szlcsc.com/upload/public/pdf/source/20210625/C2836813_35E1F3F92097F45A3828DF13DDBA01A5.pdf; Supplier: LCSC; Sensor Type: 加速度计陀螺仪; Operating Temperature: -40℃~+85℃
U6 U7 U9 = TPS7A2033PDBVR: 输出类型:固定;最大输入电压:6V;输出电压:3.3V;输出电流:300mA;输出极性:正极;; LCSC Part Name: 具有高 PSRR 的 300mA、超低噪声、低 IQ、低压降 (LDO) 线性稳压器; Supplier Part: C2862740; Manufacturer: TI(德州仪器); Supplier Footprint: SOT-23-5; JLCPCB Part Class: 扩展库; Datasheet: https://www.ti.com/cn/lit/gpn/tps7a20; Supplier: LCSC; Output Type: 固定; Maximum Input Voltage: 6V; Output Voltage: 3.3V; Output Current: 300mA; Dropout Voltage: 140mV@(300mA); standby current: 15uA; Feature: 防静电保护；软启动；浪涌保护；低ESR；热保护(TSD)；欠压闭锁；过流保护(OCP)；带使能；防倒灌; Operating Temperature: -40℃~+125℃@(Tj); Output Polarity: 正极; Number of Outputs: 1
UART1 = PM254V-11-04-H85: 插孔结构:1x4P;间距:2.54mm;行距:-;安装类型:直插;排数:单排;总孔位数:4P;塑高:-;触头材质:黄铜;触头镀层:-;; LCSC Part Name: 间距:2.54mm 1x4P 直插; Supplier Part: C541851; Manufacturer: XFCN(兴飞); Supplier Footprint: 插件,P=2.54mm; JLCPCB Part Class: Extended Part; Datasheet: https://atta.szlcsc.com/upload/public/pdf/source/20200518/C541849_85853D71FC67C51915A806977A588FDA.pdf; Supplier: LCSC; Holes Structure: 1x4P; Pitch: 2.54mm; Mounting Type: 直插; Number of Rows: 单排; Number of Holes: 4P; Contact Material: 黄铜
X1 = XC322540MOB4SA-18: 晶振类型:贴片晶振;频率:40MHz;常温频差:±10ppm;负载电容:12pF;频率稳定度:±80ppm;; LCSC Part Name: 40MHz ±10ppm 12pF; Supplier Part: C3294354; Manufacturer: YXC(扬兴晶振); Supplier Footprint: SMD3225-4P; JLCPCB Part Class: 扩展库; Datasheet: https://atta.szlcsc.com/upload/public/pdf/source/20240329/6AE8ACEB6AA3FDB5620339473EACF689.pdf; Supplier: LCSC; Type: 贴片晶振; Normal temperature Frequency Tolerance: ±10ppm; Load Capacitance: 12pF; Frequency Stability: ±80ppm; Operating Temperature: -40℃~+125℃
YLED1 = XL-302UYD: 灯头类型:3mm圆形灯头;发光颜色:黄色;功率:80mW;正向电流:30mA;主波长:585nm~590nm;透镜颜色:黄色透镜;色温:-;发光角度:50°;载带方式:-;工作温度:-25℃~+85℃;; Supplier Part: C2895472; Manufacturer: XINGLIGHT(成兴光); Supplier Footprint: 插件,D=3mm; JLCPCB Part Class: 扩展库; Datasheet: https://atta.szlcsc.com/upload/public/pdf/source/20240112/80AE8C6861133F27C2471F21BB0705B6.pdf; Supplier: LCSC; Lamp Holder Type: 3mm圆形灯头; Emitted Color: 黄色; Power Dissipation: 80mW; Forward Current: 30mA; Dominant Wavelength: 585nm~590nm; Peak Wavelength: 595nm; Lens Color: 黄色透镜; Viewing Angle: 50°; Operating Temperature: -25℃~+85℃
C4 = CC0603KRX7R9BB105: 容值:1uF;精度:±10%;额定电压:50V;材质(温度系数):X7R;; LCSC Part Name: 1uF ±10% 50V; Supplier Part: C559769; Manufacturer: YAGEO(国巨); Supplier Footprint: 0603; JLCPCB Part Class: Extended Part; Datasheet: https://atta.szlcsc.com/upload/public/pdf/source/20181031/C325451_C7CF01155AE3010E0D610C52F5FE7D31.pdf; Supplier: LCSC; Tolerance: ±10%; Voltage Rated: 50V; Temperature Coefficient: X7R
C5 = CC0603KRX7R9BB221: 容值:220pF;精度:±10%;额定电压:50V;材质(温度系数):X7R;; LCSC Part Name: 220pF ±10% 50V; Supplier Part: C107081; Manufacturer: YAGEO(国巨); Supplier Footprint: 0603; JLCPCB Part Class: Extended Part; Datasheet: https://atta.szlcsc.com/upload/public/pdf/source/20180910/C282072_33301C7F631E79921B82A8DAC6BCC5B3.pdf; Supplier: LCSC; Tolerance: ±10%; Voltage Rated: 50V; Temperature Coefficient: X7R
C6 = CC0603KRX7R9BB153: 容值:15nF;精度:±10%;额定电压:50V;材质(温度系数):X7R;; LCSC Part Name: 15nF ±10% 50V; Supplier Part: C107076; Manufacturer: YAGEO(国巨); Supplier Footprint: 0603; JLCPCB Part Class: 扩展库; Datasheet: https://atta.szlcsc.com/upload/public/pdf/source/20180910/C282072_33301C7F631E79921B82A8DAC6BCC5B3.pdf; Supplier: LCSC; Tolerance: ±10%; Voltage Rated: 50V; Temperature Coefficient: X7R
C7 = CC0603KRX7R9BB563: 容值:56nF;精度:±10%;额定电压:50V;材质(温度系数):X7R;; LCSC Part Name: 56nF ±10% 50V; Supplier Part: C282072; Manufacturer: YAGEO(国巨); Supplier Footprint: 0603; JLCPCB Part Class: Extended Part; Datasheet: https://atta.szlcsc.com/upload/public/pdf/source/20180910/C282072_33301C7F631E79921B82A8DAC6BCC5B3.pdf; Supplier: LCSC; Tolerance: ±10%; Voltage Rated: 50V; Temperature Coefficient: X7R
C8 = CC0603KRX7R9BB152: 容值:1.5nF;精度:±10%;额定电压:50V;材质(温度系数):X7R;; LCSC Part Name: 1.5nF ±10% 50V; Supplier Part: C96090; Manufacturer: YAGEO(国巨); Supplier Footprint: 0603; JLCPCB Part Class: Extended Part; Datasheet: https://atta.szlcsc.com/upload/public/pdf/source/20180910/C282072_33301C7F631E79921B82A8DAC6BCC5B3.pdf; Supplier: LCSC; Tolerance: ±10%; Voltage Rated: 50V; Temperature Coefficient: X7R
C10 = CL10C470JB8NNNC: 容值:47pF;精度:±5%;额定电压:50V;材质(温度系数):C0G;; LCSC Part Name: 47pF ±5% 50V; Supplier Part: C1671; Manufacturer: SAMSUNG(三星); Supplier Footprint: 0603; JLCPCB Part Class: 基础库; Datasheet: https://atta.szlcsc.com/upload/public/pdf/source/20160218/1457707763339.pdf; Supplier: LCSC; Tolerance: ±5%; Voltage Rated: 50V; Temperature Coefficient: C0G
C11 C23-C25 = 217EC0019: 容值:680uF;精度:±20%;额定电压:35V;纹波电流:3.65A@100kHz;等效串联电阻(ESR):28mΩ@100kHz;; LCSC Part Name: 680uF ±20% 35V; Supplier Part: C42371890; Manufacturer: KNSCHA(科尼盛); Supplier Footprint: 插件,D8xL16mm; Datasheet: https://atta.szlcsc.com/upload/public/pdf/source/20241106/965C52BEE72BE8020D9BF3C0AA67995E.pdf; Supplier: LCSC; Tolerance: ±20%; Voltage Rated: 35V; Ripple Current: 3.65A@100kHz; Equivalent Series Resistance(ESR): 28mΩ@100kHz; Lead Spacing: 3.5mm; Diameter: 8mm; Height - Seated (Max): 16mm; Lifetime @ Temp: 2000hrs@105℃; Operating Temperature: -55℃~+105℃
C12-C22 = GRM31CR61H106KA12L: 容值:10uF;精度:±10%;额定电压:50V;材质(温度系数):X5R;; LCSC Part Name: 10uF ±10% 50V; Supplier Part: C77092; Manufacturer: muRata(村田); Supplier Footprint: 1206; JLCPCB Part Class: Extended Part; Datasheet: https://atta.szlcsc.com/upload/public/pdf/source/20200305/C490387_23319AE8C154DEB24C505E6C82A8106A.pdf; Supplier: LCSC; Tolerance: ±10%; Voltage Rated: 50V; Temperature Coefficient: X5R
C26 C28-C30 C54 = GRM31CR61E226KE15L: 容值:22uF;精度:±10%;额定电压:25V;材质(温度系数):X5R;; LCSC Part Name: 22uF ±10% 25V; Supplier Part: C77091; Manufacturer: muRata(村田); Supplier Footprint: 1206; JLCPCB Part Class: 扩展库; Datasheet: https://atta.szlcsc.com/upload/public/pdf/source/20200305/C490387_23319AE8C154DEB24C505E6C82A8106A.pdf; Supplier: LCSC; Tolerance: ±10%; Voltage Rated: 25V; Temperature Coefficient: X5R
CN1 = XT30U-M: 类别:-;类型1:-;; LCSC Part Name: AMASS(艾迈斯)轻量版锂电池插头公头 XT30U-M; Supplier Part: C99101; Manufacturer: AMASS(艾迈斯); JLCPCB Part Class: 扩展库; Datasheet: https://atta.szlcsc.com/upload/public/pdf/source/20170606/1496716542582.pdf; Supplier: LCSC; Brand: 艾迈斯; Type: 插头; Colour: 黄色; InterfaceType: 公头
CN2 CN3 = XT30UPB-F30.G.Y: 类别:-;类型1:-;; LCSC Part Name: AMASS(艾迈斯)直立焊板式连接器XT30UPB30-F.G.*; Supplier Part: C108769; Manufacturer: AMASS(艾迈斯); JLCPCB Part Class: Extended Part; Datasheet: https://atta.szlcsc.com/upload/public/pdf/source/20220715/AFD68B9E8B6CA95A7295DBF4AF9325E4.pdf; Supplier: LCSC; Brand: 艾迈斯; Type: 航模插头; Colour: 黄色; RatedVoltage: DC 500V; InterfaceType: 母头; MetalMaterial: 镀金; InsulationMaterial: PA; RatedCurrent: 15A; contact resistance: 0.65mΩ
D1 D2 D4 = 1N5819WS_C191023: 正向压降(Vf):600mV@1A;直流反向耐压(Vr):40V;整流电流:1A;; LCSC Part Name: 电压:40V 电流:1A; Supplier Part: C191023; Manufacturer: Hottech(合科泰); Supplier Footprint: SOD-323; JLCPCB Part Class: Basic Part; Datasheet: https://atta.szlcsc.com/upload/public/pdf/source/20220428/3CB86FD8D28D653594B4E35F9D5AEFD9.pdf; Supplier: LCSC; Forward Voltage (Vf@If): 600mV@1A; Reverse Voltage (Vr): 40V; Rectified Current: 1A
D3 = BZT52C12_C19077410: 二极管配置:独立式;稳压值(标称值):12V;稳压值(范围):11.4V~12.6V;功率(Pd):500mW;; Supplier Part: C19077410; Manufacturer: 宏迦橙; Supplier Footprint: SOD-123; JLCPCB Part Class: Extended Part; Datasheet: https://atta.szlcsc.com/upload/public/pdf/source/20241104/A31DF82E6D0CBEC29199D0B62829516E.pdf; Supplier: LCSC; Diode Configuration: 独立式; Zener Voltage (Nom): 12V; Reverse Leakage Current (Ir): 100nA@8V; Zener Voltage (Range): 11.4V~12.6V; Power Dissipation: 500mW; Zener Impedance (Zzt): 25Ω
D5 = B5819W_C64885: 二极管配置:独立式;正向压降(Vf):900mV@3A;直流反向耐压(Vr):40V;整流电流:1A;; LCSC Part Name: 电压:40V 电流:1A 丝印SL; Supplier Part: C64885; Manufacturer: MDD(辰达半导体); Supplier Footprint: SOD-123; JLCPCB Part Class: 扩展库; Datasheet: https://atta.szlcsc.com/upload/public/pdf/source/20241121/1336DB1C0E60AD8FEBA9F692F8955C35.pdf; Supplier: LCSC; Diode Configuration: 独立式; Forward Voltage (Vf@If): 900mV@3A; Reverse Voltage (Vr): 40V; Rectified Current: 1A; Reverse Leakage Current (Ir): 1mA@40V
L1 = FEXL1010A-2R2M: 电感值:2.2uH;精度:±20%;额定电流:32A;饱和电流(Isat):34A;类型:一体成型电感;; LCSC Part Name: 2.2uH ±20% 34A; Supplier Part: C5378572; Manufacturer: cjiang(长江微电); Supplier Footprint: SMD,11.9x11mm; JLCPCB Part Class: 扩展库; Datasheet: https://atta.szlcsc.com/upload/public/pdf/source/20240409/B9FA7ECCC3220F3F7C7BE8F7B1FCE238.pdf; Supplier: LCSC; Tolerance: ±20%; Rated Current: 32A; Saturation Current (Isat): 34A; DC Resistance (DCR): 2.8mΩ; Type: 一体成型电感; Ratings: AEC-Q200
L2 = FTC303020D100MBCA: 电感值:10uH;精度:±20%;额定电流:2.5A;饱和电流(Isat):3.8A;类型:一体成型电感;; LCSC Part Name: 10uH ±20% 3.8A; Supplier Part: C7423323; Manufacturer: cjiang(长江微电); Supplier Footprint: SMD,3x3mm; JLCPCB Part Class: 扩展库; Datasheet: https://atta.szlcsc.com/upload/public/pdf/source/20230614/D39208D019DF4F1446B96572E3A14872.pdf; Supplier: LCSC; Tolerance: ±20%; Rated Current: 2.5A; Saturation Current (Isat): 3.8A; DC Resistance (DCR): 135mΩ; Type: 一体成型电感
Q1 = AGM30P100A: 类型:1个P沟道;漏源电压(Vdss):30V;连续漏极电流(Id):118A;导通电阻(RDS(on)@Vgs,Id):3.7mΩ@4.5V,10A;功率(Pd):100W;阈值电压(Vgs(th)@Id):1.2V@250uA;; LCSC Part Name: 1个P沟道 耐压:30V 电流:118A; Supplier Part: C5297493; Manufacturer: AGM-Semi(芯控源); Supplier Footprint: PDFN(5x6); JLCPCB Part Class: 扩展库; Datasheet: https://atta.szlcsc.com/upload/public/pdf/source/20240724/4C0371A24D5182A33B38810A6861A1E7.pdf; Supplier: LCSC; Type: 1个P沟道; Drain Source Voltage (Vdss): 30V; Continuous Drain Current (Id): 118A; Drain Source On Resistance (RDS(on)@Vgs,Id): 3.7mΩ@4.5V,10A; Power Dissipation (Pd): 100W; Gate Threshold Voltage (Vgs(th)@Id): 1.2V@250uA; Total Gate Charge (Qg@Vgs): 122nC@10V; Input Capacitance (Ciss@Vds): 5.7nF@15V; Reverse Transfer Capacitance (Crss@Vds): 755pF@15V; Operating Temperature: -55℃~+150℃
Q2-Q5 = BSC0702LS: 类型:1个N沟道;漏源电压(Vdss):60V;连续漏极电流(Id):100A;功率(Pd):83W;导通电阻(RDS(on)@Vgs,Id):2.3mΩ@10V,50A;阈值电压(Vgs(th)@Id):2.3V@49uA;; LCSC Part Name: 1个N沟道 耐压:60V 电流:100A; Supplier Part: C501503; Manufacturer: Infineon(英飞凌); Supplier Footprint: TDSON-8-EP(5x6); JLCPCB Part Class: 扩展库; Datasheet: https://atta.szlcsc.com/upload/public/pdf/source/20200324/C501503_BE3C55BAEEDCAD77F3934BFEE5415F86.pdf; Supplier: LCSC; Type: 1个N沟道; Drain Source Voltage (Vdss): 60V; Continuous Drain Current (Id): 100A; Power Dissipation (Pd): 83W; Drain Source On Resistance (RDS(on)@Vgs,Id): 2.3mΩ@10V,50A; Gate Threshold Voltage (Vgs(th)@Id): 2.3V@49uA
R1 R2 = 0603WAF2001T5E: 电阻类型:厚膜电阻;阻值:2kΩ;精度:±1%;功率:100mW;最大工作电压:75V;温度系数:±100ppm/℃;; LCSC Part Name: 2kΩ ±1% 100mW 厚膜电阻; Supplier Part: C22975; Manufacturer: UNI-ROYAL(厚声); Supplier Footprint: 0603; JLCPCB Part Class: 基础库; Datasheet: https://atta.szlcsc.com/upload/public/pdf/source/20200306/C422600_1E6D84923E4A46A82E41ADD87F860B5C.pdf; Supplier: LCSC; Type: 厚膜电阻; Tolerance: ±1%; Power(Watts): 100mW; Overload Voltage (Max): 75V; Temperature Coefficient: ±100ppm/℃; Operating Temperature Range: -55℃~+155℃
R4 = FRC0603F9312TS: 电阻类型:厚膜电阻;阻值:93.1kΩ;精度:±1%;功率:100mW;最大工作电压:75V;温度系数:±100ppm/℃;; LCSC Part Name: 93.1kΩ ±1% 100mW 厚膜电阻; Supplier Part: C2933266; Manufacturer: FOJAN(富捷); Supplier Footprint: 0603; Datasheet: https://atta.szlcsc.com/upload/public/pdf/source/20211221/925EC7D7225764EE0046F22065062C87.pdf; Supplier: LCSC; Type: 厚膜电阻; Tolerance: ±1%; Power(Watts): 100mW; Overload Voltage (Max): 75V; Temperature Coefficient: ±100ppm/℃; Operating Temperature Range: -55℃~+155℃
R5 R13 = RC0603FR-0720KL: 电阻类型:厚膜电阻;阻值:20kΩ;精度:±1%;功率:100mW;最大工作电压:75V;温度系数:±100ppm/℃;; LCSC Part Name: 厚膜电阻 20kΩ ±1% 100mW; Supplier Part: C105575; Manufacturer: YAGEO(国巨); Supplier Footprint: 0603; JLCPCB Part Class: Extended Part; Datasheet: https://atta.szlcsc.com/upload/public/pdf/source/20180821/C275644_0D56F95EFF785E7D9A1FEF436B37DA78.pdf; Supplier: LCSC; Type: 厚膜电阻; Tolerance: ±1%; Power(Watts): 100mW; Overload Voltage (Max): 75V; Temperature Coefficient: ±100ppm/℃; Operating Temperature Range: -55℃~+155℃
R10 = 0603WAF2053T5E: 电阻类型:厚膜电阻;阻值:205kΩ;精度:±1%;功率:100mW;最大工作电压:75V;温度系数:±100ppm/℃;; LCSC Part Name: 205kΩ ±1% 100mW 厚膜电阻; Supplier Part: C22949; Manufacturer: UNI-ROYAL(厚声); Supplier Footprint: 0603; JLCPCB Part Class: 扩展库; Datasheet: https://atta.szlcsc.com/upload/public/pdf/source/20200306/C422600_1E6D84923E4A46A82E41ADD87F860B5C.pdf; Supplier: LCSC; Type: 厚膜电阻; Tolerance: ±1%; Power(Watts): 100mW; Overload Voltage (Max): 75V; Temperature Coefficient: ±100ppm/℃; Operating Temperature Range: -55℃~+155℃
R11 R12 R14 R15 = FRC0603F1R50TS: 电阻类型:厚膜电阻;阻值:1.5Ω;精度:±1%;功率:100mW;工作电压:75V;温度系数:±200ppm/℃;; LCSC Part Name: 1.5Ω ±1% 100mW 厚膜电阻; Supplier Part: C2906978; Manufacturer: FOJAN(富捷); Supplier Footprint: 0603; JLCPCB Part Class: Extended Part; Datasheet: https://atta.szlcsc.com/upload/public/pdf/source/20211221/925EC7D7225764EE0046F22065062C87.pdf; Supplier: LCSC; Type: 厚膜电阻; Tolerance: ±1%; Power(Watts): 100mW; Voltage-Supply(Max): 75V; Temperature Coefficient: ±200ppm/℃; Operating Temperature: -55℃~+155℃
Rs1 = HoBB1216-3W-2mR-1%: 电阻类型:采样电阻;阻值:2mΩ;精度:±1%;功率:3W;温度系数:±50ppm/℃;安装方式:贴片;; LCSC Part Name: 2mΩ ±1% 3W; Supplier Part: C17701558; Manufacturer: Milliohm(毫欧); Supplier Footprint: 1216; JLCPCB Part Class: 扩展库; Datasheet: https://atta.szlcsc.com/upload/public/pdf/source/20230912/1B8806392F8E19F4A89C9806AF6987AF.pdf; Supplier: LCSC; Type: 采样电阻; Tolerance: ±1%; Power(Watts): 3W; Temperature Coefficient: ±50ppm/℃; Mounting Sytle: 贴片
SCREW1-SCREW4 = M2螺丝（2.35）
SW1 = SS-3235S-L3: 电路结构:双刀双掷;安装方式:立贴;开关颜色:黑色;额定电流(DC):50mA;额定电压(DC):12V;额定电流(AC):50mA;额定电压(AC):12V;机械寿命:1万次;; LCSC Part Name: 柄长4mm 立贴双档 滑动开关; Supplier Part: C381098; Manufacturer: XKB Connectivity(中国星坤); Supplier Footprint: SMD; JLCPCB Part Class: 扩展库; Datasheet: https://atta.szlcsc.com/upload/public/pdf/source/20200227/C381098_2A18B7660478ED4C962829E19BCD5514.pdf; Supplier: LCSC; Circuit: 双刀双掷; Actuator Style: 矩形柱状; Pin Style: SMD接片; Switch Length: 9.1mm; Switch Width: 3.55mm; Switch Height: 6.6mm; Mounting Style: 立贴; Actuator Color: 黑色; Current Rating (DC): 50mA; Voltage Rating (DC): 12V; Current Rating (AC): 50mA; Voltage Rating (AC): 12V; Mechanical Life: 1万次; Operating Temperature: -40℃~+85℃
U1 = LM5176PWPR: 功能类型:升降压型;输入电压:4.2V~55V;; Supplier Part: C442493; Manufacturer: TI(德州仪器); Supplier Footprint: HTSSOP-28-EP; JLCPCB Part Class: 扩展库; Datasheet: https://www.ti.com/cn/lit/gpn/lm5176; Supplier: LCSC; Function: 升降压型; Input Voltage: 4.2V~55V; Switching Frequency: 600kHz; Synchronous Rectification: 是; Number of Outputs: 1; Topology: 升压式；降压式
U5 = SCT2325TVBR: LCSC Part Name: 电源IC; Supplier Part: C509064; Manufacturer: SCT(芯洲科技); Supplier Footprint: TSOT-23-6L; JLCPCB Part Class: 扩展库; Datasheet: https://atta.szlcsc.com/upload/public/pdf/source/20200407/C509063_826B654C744DE67103EF2170C75A64D4.pdf; Supplier: LCSC

## Nets
3V3: C34.2 IPS1.2 R20.2 R50.2 R56.2 RN3.5 RN3.6 RN3.7 RN3.8 RN4.5 RN4.6 RN4.7 RN4.8 RUNNING1.1 U7.5(OUT)
+5V: ADCS1.1 ADCS2.1 ADCS3.1 C30.2 C31.2 C33.2 C35.2 C37.2 C52.2 D5.1(K) H2.1 R44.1 U5.1(VS) U6.1(IN) U7.1(IN) U7.3(EN) U9.1(IN) U9.3(EN)
+9V: C1.2 C16.2 C17.2 C18.2 C19.2 C20.2 C21.2 C22.2 C23.1 C24.1 C25.1 C26.2 C28.2 C53.2 CN2.1(+) CN3.1(+) Q3.5(D) Q3.6(D) Q3.7(D) Q3.8(D) R10.2 R58.1 U1.12(VOSNS) U1.24(BIAS) U5.2(EN) U5.3(VIN)
GND: ADCL1.2 ADCL2.2 ADCL3.2 ADCS1.2 ADCS1.3 ADCS1.4 ADCS2.2 ADCS2.3 ADCS2.4 ADCS3.2 ADCS3.3 ADCS3.4 C1.1 C2.2 C4.2 C5.1 C6.1 C8.1 C11.2 C12.1 C13.1 C14.1 C15.1 C16.1 C17.1 C18.1 C19.1 C20.1 C21.1 C22.1 C23.2 C24.2 C25.2 C26.1 C28.1 C29.1 C30.1 C31.1 C32.1 C33.1 C34.1 C35.1 C36.1 C37.1 C38.1 C39.1 C40.1 C41.1 C42.2 C43.1 C44.1 C45.1 C52.1 C53.1 C54.1 CN1.2 CN2.2(-) CN3.2(-) DIPZ1.3(B2) DIPZ1.4(B1) DIPZ2.1 DIPZ2.2 DIPZ2.3 DIPZ2.4 DIPZ2.5 DIPZ2.6 GLED1.2(K) H1.1 H1.3 H1.5 IPS1.1 KEY0.2 KEY1.2 KEY2.2 KEY3.2 LED1.1(K) LED2.1(K) LED3.1(K) LED5.1(K) Q6.2(E) R4.1 R5.1 R6.2 R7.1 R13.1 R40.1 R52.2 RLED1.2 RLED2.2 Rs1.2 RUNNING1.2 SW2.2 U1.5(DITH) U1.10(AGND) U1.13(ISNS(-)) U1.14(ISNS(+)) U1.22(PGND) U1.29(EP) U2.17(Gnd/ADC_AGnd/ADC_Vref-) U5.4(GND) U6.2(GND) U6.4(NC) U7.2(GND) U7.4(NC) U8.6(GNDIO) U8.7(GND) U9.2(GND) U9.4(NC) UART1.2 UART3.3 UART4.3 X1.2(GND) X1.4(GND) YLED1.2(K)
VCC: C4.1 D2.2(A) D4.2(A) U1.23(VCC)
VIN: C11.1 C12.2 C13.2 C14.2 C15.2 D1.2(A) Q1.5(D) Q1.6(D) Q1.7(D) Q1.8(D) Q1.9(D) Q2.5(D) Q2.6(D) Q2.7(D) Q2.8(D) R1.2 R2.2 R41.2 R57.1
ADC_L1: ADCL1.3 U2.4(I2SCK_2/QSPICLK/PWM8_2/PWM4N/SCLK/TxD_3/ADC7/P1.7)
ADC_L2: ADCL1.1 U2.3(I2SMCLK_4/I2SMCLK_2/QSPIIO1/PWM4P/MISO/RxD_3/ADC6/P1.6)
ADC_M1: ADCL3.3 U2.40(PWM1P_2/RxD3/AD0/ADC8/P0.0)
ADC_M2: ADCL3.1 U2.39(PWM5/PWM1N_2/TxD3/AD1/ADC9/P0.1)
ADC_R1: ADCL2.3 U2.38(PWM2P_2/RxD4/AD2/ADC10/P0.2)
ADC_R2: ADCL2.1 U2.37(PWM6/PWM2N_2/TxD4/AD3/ADC11/P0.3)
ADC_VIN: R40.2 R41.1 U2.2(I2SSD_2/QSPIIO0/PWM7_2/PWM3N/SCL_2/MOSI/ADC5/P1.5)
BEEP: R51.2 R52.1 U2.33(P0.7/AD7/T4CLKO/PWM4N_2/PWM8/PWMFLT_3)
CSG: R8.1 Rs1.4
DIP1: RN1.6 RN3.3 U2.13(P3.6/INT2/WR_2/RxD_2)
DIP2: RN1.5 RN3.4 U2.14(P3.7/INT3/RD_2/TxD_2)
DIP3: RN2.8 RN4.1 U2.47(I2SWS_2/QSPINCS/PWM3P/CCP1/SDA_2/SS/ADC4/P1.4)
DIP4: RN2.7 RN4.2 U2.23(P2.4/A12/SS_2/SCL/PWM3P_3)
DIP5: RN2.6 RN4.3 U2.32(P4.6/CMP+/QSPIIO2_3)
DIP6: RN2.5 RN4.4 U2.30(P4.5/ALE/CMPO/QSPIIO3_3/P4.4/RD/TxD_4/CCP2_2/PWMAPS5_2/CMP-)
DIP7: RN1.8 RN3.1 U2.27(P2.6/A14/MISO_2/PWM4P_3/QSPIIO1_3)
DIP8: RN1.7 RN3.2 U2.12(I2SWS/PWMFLT/SS_4/T0CLKO/T1/P3.5)
FB: R10.1 R13.2 U1.11(FB)
HDRV1: R11.1 U1.27(HDRV1)
HDRV2: R12.2 U1.19(HDRV2)
IMU_3V3: C36.2 C38.2 C39.2 C40.2 R21.2 R23.2 R24.1 R25.1 R26.1 U8.5(VDDIO) U8.8(VDD) U9.5(OUT)
IMU_CS: R26.2 U2.18(P4.0/SS_3/ADCETR_2/QSPINCS_2/I2SWS_4) U8.12(CSB)
IMU_SDI: R24.2 U2.31(P4.1/CMPO_2/ECI_2/MOSI_3/PWMETI1_2/PWMETI2_2/QSPIIO0_2/I2SSD_4) U8.14(SDX)
IMU_SDO: R23.1 R27.1 U2.42(QSPIIO1_2/CCP0_2/MISO_3/RxD2_2/WR/P4.2)
IMU_SPC: R25.2 U2.7(I2SCK_4/QSPICLK_2/CCP1_2/SCLK_3/TxD2_2/RxD_4/P4.3) U8.13(SCX)
IPS_BLK: IPS1.8 U2.22(P2.3/A11/SDA/ECI_3/PWM2N_3/PWM6_3/PWM_ETI1_3/PWM_ETI2_3/I2SCK_3)
IPS_CS: IPS1.7 U2.21(P2.2/A10/CCP2_3/PWM2P_3/I2SMCLK_3)
IPS_DC: IPS1.6 U2.20(P2.1/A9/T11CLKO/CCP1_3/PWM1N_3/PWM5_3/I2SSD_3)
IPS_RST: IPS1.5 U2.19(P2.0/A8/T11/CCP0_3/PWM1P_3/ADCETR_3/I2SWS_3)
IPS_SCL: IPS1.3 U2.28(P2.7/A15/SCLK_2/PWM4N_3/PWM8_3/QSPICLK_3)
IPS_SDA: IPS1.4 U2.26(P2.5/A13/MOSI_2/PWM3N_3/PWM7_3/QSPIIO0_3)
K_NRST: R45.1 U2.5(PWMAPS6_2/QSPINCS_3/ADC_ETR/MCLKO/nRST/P4.7)
KEY0: R46.1 U2.46(QSPIIO2/PWM6_2/PWM2N/CCP0/TxD2/ADC3/P1.3)
KEY2: R47.1 U2.10(PWMAPS5/I2SMCLK/SDA_4/MISO_4/INT1/P3.3)
KEY3: R48.1 U2.11(PWMAPS6/I2SSD/MOSI_4/T1CLKO/T0/P3.4)
LDRV1: R14.1 U1.25(LDRV1)
LDRV2: R15.2 U1.21(LDRV2)
LED_G: GLED1.1(A) U2.43(PWM1P/T2/ADC0/P1.0)
LED_R: RLED1.1 U2.44(PWM5_2/PWM1N/CCP2/T2CLKO/ADC1/P1.1)
LED_Y: U2.45(QSPIIO3/PWMETI2_4/PWMETI1_4/PWM2P/ECI/RxD2/ADC2/P1.2) YLED1.1(A)
P0.4: H1.6 U2.36(P0.4/ADC12/AD4/T3/PWM3P_2)
P0.5: H1.4 U2.35(P0.5/ADC13/AD5/T3CLKO/PWM3N_2/PWM7)
P0.6: H1.2 U2.34(P0.6/ADC14/AD6/T4/PWM4P_2/PWMFLT_2)
RCS: R9.1 Rs1.3
RUNNING: R55.1 U2.9(I2SCK/PWM_ETI2/PWM_ETI1/SCL_4/SCLK_4/INT0/P3.2)
RX1: U2.6(D-/RxD/INT4/P3.0) UART1.3
RX3: R31.1 UART3.1
RX4: R28.2 UART4.1
STC_3V3: C32.2 C43.2 C44.2 R18.2 U2.41(ADC_VRef+/ADC_AVcc/Vcc) U6.5(OUT)
SW1: C3.2 L1.1 Q2.1(S) Q2.2(S) Q2.3(S) Q4.5(D) Q4.6(D) Q4.7(D) Q4.8(D) U1.28(SW1)
SW2: C9.2 L1.2 Q3.1(S) Q3.2(S) Q3.3(S) Q5.5(D) Q5.6(D) Q5.7(D) Q5.8(D) U1.18(SW2)
TX1: U2.8(D+/TxD/P3.1) UART1.4
TX3: R32.2 UART3.2
TX4: R33.1 UART4.2
VCAP: CN1.1 D3.1(K) Q1.1(S) Q1.2(S) Q1.3(S) SW1.3 SW1.6
$1N903: C2.1 R3.1 U1.2(VIN)
$1N1101: R2.1 U1.3(VISNS)
$1N1220: R4.2 U1.4(MODE)
$1N1330: R5.2 U1.6(RT)
$1N1402: C5.2 U1.7(SLOPE)
$1N1711: C6.2 U1.8(SS)
$1N1716: C7.1 C8.2 U1.9(COMP)
$1N2046: C10.1 R8.2 U1.15(CSG)
$1N2059: C10.2 R9.2 U1.16(CS)
$1N2215: C3.1 D2.1(K) U1.26(BOOT1)
$1N23253: D1.1(K) R3.2
$1N28303: R1.1 U1.1(EN/UVLO)
$1N30337: Q4.1(S) Q4.2(S) Q4.3(S) Q5.1(S) Q5.2(S) Q5.3(S) Rs1.1
$1N30672: Q3.4(G) R12.1
$1N30676: Q2.4(G) R11.2
$1N30680: Q4.4(G) R14.2
$1N30684: Q5.4(G) R15.1
$1N30960: C9.1 D4.1(K) U1.20(BOOT2)
$1N33364: D3.2(A) R6.1 SW1.1 SW1.4
$1N33503: Q1.4(G) SW1.2 SW1.5
$1N39218: C7.2 R7.2
$1N43993: LED1.2(A) R18.1
$1N44340: LED2.2(A) R20.1
$1N44411: R44.2 SW2.1 U6.3(EN)
$1N46790: R57.2 RLED2.1
$1N58470: LED5.2(A) R58.2
$1N58582: C29.2 C54.2 D5.2(A) L2.2
$1N58732: C27.2 U5.6(BST)
$1N58737: C27.1 L2.1 U5.5(SW)
$3N718: LED3.2(A) R21.1
$3N1301: R27.2 U8.1(SDO)
$3N1430: C42.1 U2.16(P5.7/XTALI/PWMAPS6_3) X1.1
$3N1436: C41.2 U2.15(P5.6/XTALO/MCLKO_2/PWMAPS5_3) X1.3
$3N2154: C45.2 U2.29(UCAP)
$3N2428: R31.2 U2.24(P5.0/RxD3_2/PWM5_4/CMP+_2)
$3N2431: R32.1 U2.25(P5.1/TxD3_2/PWM6_4/CMP+_3)
$3N2686: R28.1 U2.48(QSPIIO2_2/PWM7_4/RxD4_2/P5.2)
$3N2803: R33.2 U2.1(QSPIIO3_2/PWM8_4/TxD4_2/P5.3)
$3N4387: KEY1.1 R45.2
$3N4484: KEY0.1 R46.2
$3N4581: KEY2.1 R47.2
$3N4678: KEY3.1 R48.2
$3N5200: BUZZER1.1(+) R50.1
$3N5220: BUZZER1.2 Q6.3(C)
$3N5339: Q6.1(B) R51.1
$3N5727: R55.2 R56.1 RUNNING1.3
$3N6338: H2.2 UART1.1
$3N9278: DIPZ1.1(A1) RN1.4
$3N9287: DIPZ1.2(A2) RN1.3
$3N30391: DIPZ2.7 RN2.1
$3N30392: DIPZ2.8 RN2.2
$3N30471: DIPZ2.9 RN2.3
$3N30472: DIPZ2.10 RN2.4
$3N30551: DIPZ2.11 RN1.1
$3N30552: DIPZ2.12 RN1.2

Not connected (* = marked no-connect by the designer): H2 3*; SCREW1 1*; SCREW2 1*; SCREW3 1*; SCREW4 1*; SCREW5 1*; SCREW6 1*; U1 17(PGOOD)*; U8 2(ASDX)* 3(ASCX)* 4(INT1)* 9(INT2)* 10(OCSB)* 11(OSDO)*

## Notes on the sheets
sheet 1
- 电源开关
- LM5176
- 单片机-3V3电源
- 5V电源
- 9V电源
- 其他-3V3电源
- 电源接口
sheet 2
- AI8051
- IMU
- 显示屏
- 指示灯
- 电磁巡线
- 电压采样
- 按键
- 下载调试串口
- 有源蜂鸣器
- 起跑检测
- 拨码开关
- 电机串口接口
- 调试/备用接口
- 电感电源
